# EAGLE design IoT_Pro_01 (EAGLE 7.3.0)
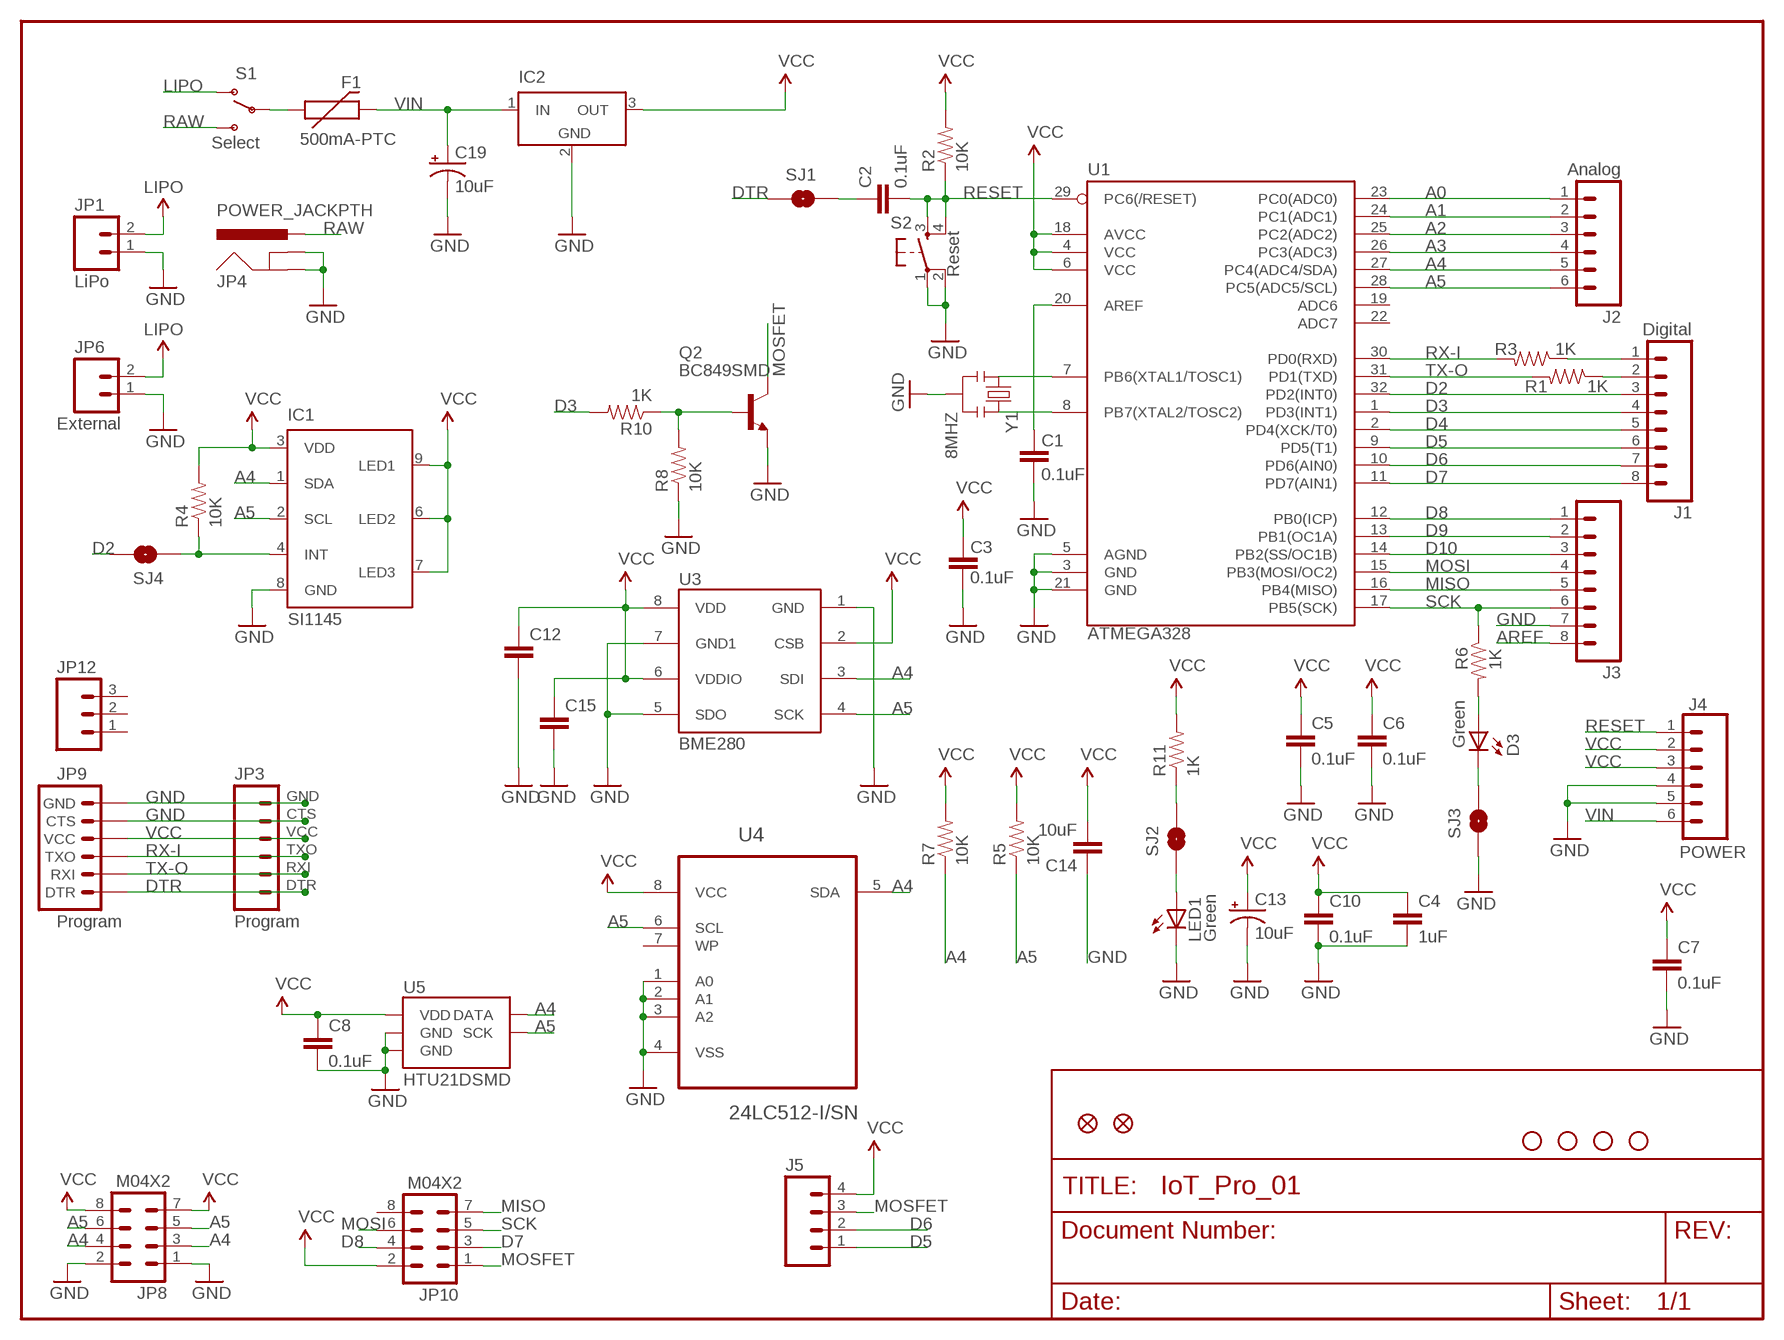
[diagram p0: schematic, sheet 1]

## Parts
C1  0.1uF  CAP0805  [0805]
C2  0.1uF  CAP0805  [0805]
C3  0.1uF  CAP0805  [0805]
C4  1uF  CAP0805  [0805]
C5  0.1uF  CAP0805  [0805]
C6  0.1uF  CAP0805  [0805]
C7  0.1uF  CAP0805  [0805]
C8  0.1uF  CAP0805  [0805]
C10  0.1uF  CAP0805  [0805]
C12  CAP0805  [0805]
C13  10uF  CAP_POL1206  [EIA3216]
C14  10uF  CAP0805  [0805]
C15  CAP0805  [0805]
C19  10uF  CAP_POL1206  [EIA3216]
D3  Green  LG_T679-E1F1-1  [PLCC2]
F1  500mA-PTC  PTCSMD  [PTC-1206]
IC1  SI1145  [QFN-10]
IC2  LT1129CST5  [SOT223]
J1  Digital  M081X08  [1X08]
J2  Analog  M06SIP  [1X06]
J3  M081X08  [1X08]
J4  POWER  M06SIP  [1X06]
J5  M04PTH  [1X04]
JP1  LiPo  M02POLAR  [MOLEX-1X2]
JP2  FIDUCIAL1X2.5  [FIDUCIAL-1X2.5]
JP3  Program  M06SIP  [1X06]
JP4  POWER_JACKPTH  [POWER_JACK_PTH]
JP5  FIDUCIAL1X2.5  [FIDUCIAL-1X2.5]
JP6  External  M02PTH  [1X02]
JP8  M04X2  [2X4]
JP9  Program  ARDUINO_SERIAL_PROGRAMSMD  [1X06-SMD]
JP10  M04X2  [2X4]
JP12  M03PTH  [1X03]
LED1  Green  LG_T679-E1F1-1  [PLCC2]
Q2  BC849SMD  [SOT23-BEC]
R1  1K  RESISTOR0805-RES  [0805]
R2  10K  RESISTOR0805-RES  [0805]
R3  1K  RESISTOR0805-RES  [0805]
R4  10K  RESISTOR0805-RES  [0805]
R5  10K  RESISTOR0805-RES  [0805]
R6  1K  RESISTOR0805-RES  [0805]
R7  10K  RESISTOR0805-RES  [0805]
R8  10K  RESISTOR0805-RES  [0805]
R10  1K  RESISTOR0805-RES  [0805]
R11  1K  RESISTOR0805-RES  [0805]
S1  Select  SWITCH-SPDT-SMD-A  [SWITCH-SPST-SMD-A]
S2  Reset  TAC_SWITCHSMD  [TACTILE_SWITCH_SMD]
SJ1  SOLDERJUMPERNC2  [SJ_2S-NOTRACE]
SJ2  SOLDERJUMPERNC2  [SJ_2S-NOTRACE]
SJ3  SOLDERJUMPERNC2  [SJ_2S-NOTRACE]
SJ4  SOLDERJUMPERNC2  [SJ_2S-NOTRACE]
U1  ATMEGA328  ATMEGA168  [TQFP32-08]
U3  BME280  [BME280]
U4  24LC512-I/SN  [SOIC127P600X175-8N]
U5  HTU21DSMD  [HTU21D]
U$1  STAND-OFFTIGHT  [STAND-OFF-TIGHT]
U$3  STAND-OFFTIGHT  [STAND-OFF-TIGHT]
U$9  STAND-OFFTIGHT  [STAND-OFF-TIGHT]
U$10  STAND-OFFTIGHT  [STAND-OFF-TIGHT]
Y1  8MHZ  RESONATOR8MHZ  [RESONATOR-SMD]

## Nets
A0: J2.1 U1.23(PC0(ADC0))
A1: J2.2 U1.24(PC1(ADC1))
A2: J2.3 U1.25(PC2(ADC2))
A3: J2.4 U1.26(PC3(ADC3))
A4: IC1.1(SDA) J2.5 JP8.3 JP8.4 R7.1 U1.27(PC4(ADC4/SDA)) U3.3(SDI) U4.5(SDA) U5.DATA
A5: IC1.2(SCL) J2.6 JP8.5 JP8.6 R5.1 U1.28(PC5(ADC5/SCL)) U3.4(SCK) U4.6(SCL) U5.SCK
AREF: C1.2 J3.8 U1.20(AREF)
D2: J1.3 SJ4.2 U1.32(PD2(INT0))
D3: J1.4 R10.2 U1.1(PD3(INT1))
D4: J1.5 U1.2(PD4(XCK/T0))
D5: J1.6 J5.1 U1.9(PD5(T1))
D6: J1.7 J5.2 U1.10(PD6(AIN0))
D7: J1.8 JP10.3 U1.11(PD7(AIN1))
D8: J3.1 JP10.4 U1.12(PB0(ICP))
D9: J3.2 U1.13(PB1(OC1A))
D10: J3.3 U1.14(PB2(SS/OC1B))
DTR: JP3.DTR JP9.1(DTR) SJ1.1
GND [vcc]: C1.1 C3.1 C4.2 C5.2 C6.2 C7.2 C8.2 C10.2 C12.2 C13.C(-) C14.1 C15.2 C19.C(-) IC1.8(GND) IC2.2(GND) J3.7 J4.4 J4.5 JP1.1 JP3.CTS JP3.GND JP4.GND JP4.GNDBREAK JP6.1 JP8.1 JP8.2 JP9.5(CTS) JP9.6(GND) LED1.C Q2.E R8.1 S2.1 S2.2 SJ3.1 U1.3(GND) U1.5(AGND) U1.21(GND) U3.1(GND) U3.5(SDO) U3.7(GND1) U4.1(A0) U4.2(A1) U4.3(A2) U4.4(VSS) U5.7(GND) U5.GND Y1.2
LIPO: JP1.2 JP6.2 S1.1(O)
MISO: J3.5 JP10.7 U1.16(PB4(MISO))
MOSFET: J5.3 JP10.1 Q2.C
MOSI: J3.4 JP10.6 U1.15(PB3(MOSI/OC2))
N$1: C2.1 SJ1.2
N$3: U1.7(PB6(XTAL1/TOSC1)) Y1.1
N$4: U1.8(PB7(XTAL2/TOSC2)) Y1.3
N$6: LED1.A SJ2.1
N$7: D3.A R6.2
N$8: R11.1 SJ2.2
N$9: D3.C SJ3.2
N$10: IC1.4(INT) R4.1 SJ4.1
N$14: Q2.B R8.2 R10.1
N$25: F1.1 S1.2(P)
RAW [vcc]: JP4.PWR S1.3(S)
RESET: C2.2 J4.1 R2.1 S2.3 S2.4 U1.29(PC6(/RESET))
RX-I: JP3.TXO JP9.3(TXO) R3.2 U1.30(PD0(RXD))
RX-IP: J1.2 R1.1
SCK: J3.6 JP10.5 R6.1 U1.17(PB5(SCK))
TX-O: JP3.RXI JP9.2(RXI) R1.2 U1.31(PD1(TXD))
TX-OP: J1.1 R3.1
VCC: C3.2 C4.1 C5.1 C6.1 C7.1 C8.1 C10.1 C12.1 C13.A(+) C14.2 C15.1 IC1.3(VDD) IC1.6(LED2) IC1.7(LED3) IC1.9(LED1) IC2.3(OUT) J4.2 J4.3 J5.4 JP3.VCC JP8.7 JP8.8 JP9.4(VCC) JP10.2 R2.2 R4.2 R5.2 R7.2 R11.2 U1.4(VCC) U1.6(VCC) U1.18(AVCC) U3.2(CSB) U3.6(VDDIO) U3.8(VDD) U4.8(VCC) U5.VDD
VIN [vcc]: C19.A(+) F1.2 IC2.1(IN) J4.6
Unconnected: JP10.8 JP12.1 JP12.2 JP12.3 U1.19(ADC6) U1.22(ADC7) U4.7(WP)

## Power pins joined to a net without a drawn wire
GND: IC2.4(GND)

## Library data of the parts
C1-C8 C10 = SparkFun:CAP: Capacitor Standard 0603 ceramic capacitor, and 0.1" leaded capacitor.
C12 C14 C15 = SparkFun-Capacitors:CAP: Capacitor Standard 0603 ceramic capacitor, and 0.1" leaded capacitor.
C13 C19 = SparkFun:CAP_POL: Capacitor Polarized These are standard SMD and PTH capacitors. Normally 10uF, 47uF, and 100uF in electrolytic and tantalum varieties. Always verify the external diameter of the through hole cap, it varies with capacity, voltage, and manufacturer. The EIA devices should be standard.
D3 LED1 = led:*_T679-?-1: LC TOPLED® Low Current LED Source: http://catalog.osram-os.com .. LG_LS_LY_T679_OBS.pdf; COLOR: green
F1 = SparkFun:PTC: Resettable Fuse PTC Resettable Fuse. Spark Fun Electronics SKU : COM-08357
IC1 = silabs:SI114*: PROXIMITY/UV/AMBIENT LIGHT SENSOR IC WITH I2C INTERFACE Source: http://www.silabs.com/Support%20Documents/TechnicalDocs/Si1145-46-47.pdf
IC2 = linear-technology:LT1129CST5: VOLTAGE REGULATOR with shutdown; MPN: LT1129CST-5#PBF; OC_FARNELL: 1663375; OC_NEWARK: 57M2069
J1 J3 = SparkFun:M08: Header 8 Standard 8-pin 0.1" header. Use with straight break away headers (SKU : PRT-00116), right angle break away headers (PRT-00553), swiss pins (PRT-00743), machine pins (PRT-00117), and female headers (PRT-00115).
J2 J4 = SparkFun:M06: Header 6 Standard 6-pin 0.1" header. Use with straight break away headers (SKU : PRT-00116), right angle break away headers (PRT-00553), swiss pins (PRT-00743), machine pins (PRT-00117), and female headers (PRT-00115). Molex polarized connector foot print use with SKU : PRT-08094 with associated ...
J5 = SparkFun-Connectors:M04: Header 4 Standard 4-pin 0.1" header. Use with straight break away headers (SKU : PRT-00116), right angle break away headers (PRT-00553), swiss pins (PRT-00743), machine pins (PRT-00117), and female headers (PRT-00115). Molex polarized connector foot print use with SKU : PRT-08231 with associated crimp pins and housings. 1MM SMD Version SKU: PRT-10208; PROD_ID: CONN-09696
JP1 = SparkFun-Connectors:M02: Standard 2-pin 0.1" header. Use with - straight break away headers ( PRT-00116) - right angle break away headers (PRT-00553) - swiss pins (PRT-00743) - machine pins (PRT-00117) - female headers (PRT-00115) Molex polarized connector foot print use with: PRT-08233 with associated crimp pins and housings. 2.54_SCREWTERM for use with PRT-10571. 3.5mm Screw Terminal footprints for PRT-08084 5mm Screw Terminal footprints for use with PRT-08432
JP2 JP5 = abes:FIDUCIAL: Fiducial Alignment Points Various fiducial points for machine vision alignment.
JP3 = SparkFun-Connectors:M06: Header 6 Standard 6-pin 0.1" header. Use with straight break away headers (SKU : PRT-00116), right angle break away headers (PRT-00553), swiss pins (PRT-00743), machine pins (PRT-00117), and female headers (PRT-00115). Molex polarized connector foot print use with SKU : PRT-08094 with associated ...
JP4 = SparkFun:POWER_JACK: Power Jack This is the standard 5.5mm barrel jack for power. The PTH is the most common, proven, reliable, footprint. All others are experimental. The Slot footprint only works if the mill layer is transmitted to the PCB fab house so be warned. Spark Fun Electronics SKU : PRT-00119. Mating wall wart : TOL-00298 (and others)
JP6 = SparkFun:M02: Header 2 Standard 2-pin 0.1" header. Use with straight break away headers (SKU : PRT-00116), right angle break away headers (PRT-00553), swiss pins (PRT-00743), machine pins (PRT-00117), and female headers (PRT-00115). Molex polarized connector foot print use with SKU : PRT-08233 with associated crimp pins and housings.
JP8 JP10 = SparkFun-Connectors:M04X2: .1" header, two rows of four.
JP9 = SparkFun:ARDUINO_SERIAL_PROGRAM
JP12 = SparkFun-Connectors:M03: Header 3 Standard 3-pin 0.1" header. Use with straight break away headers (SKU : PRT-00116), right angle break away headers (PRT-00553), swiss pins (PRT-00743), machine pins (PRT-00117), and female headers (PRT-00115). Molex polarized connector foot print use with SKU : PRT-08232 with associated crimp pins and housings.
Q2 = transistor-npn:BC849*: NPN Transistor
R1-R8 R10 R11 = SparkFun:RESISTOR: Resistor Basic schematic elements and footprints for 0603, 1206, and PTH resistors.
S1 = SparkFun-Electromechanical:SWITCH-SPDT: SPDT Switch Simple slide switch, Spark Fun Electronics SKU : COM-00102 DPDT SMT slide switch, AYZ0202, SWCH-08179
S2 = SparkFun:TAC_SWITCH: Momentary Switch Button commonly used for reset or general input. Spark Fun Electronics SKU : COM-00097
SJ1-SJ4 = SparkFun:SOLDERJUMPER: Solder Jumper Standard SMD solder jumper. Used to automate production. Two varients : Normally Open and Normally Closed are the same, but have different paste layers. NC will have a large amount of paste and should jumper during reflow.
U1 = SparkFun:ATMEGA168
U3 = mojaknižnica:BME280: BOSCH BME280
U4 = Microchip-24LCxxx:24LC: IC, I2C™ Serial EEPROM; MPN: 24LC512-I/SN; OC_FARNELL: 1801220; OC_NEWARK: 08R2186; PACKAGE: SOIC-8; SUPPLIER: MICROCHIP
U5 = SparkFun-Sensors:HTU21D
U$1 U$3 U$9 U$10 = SparkFun-Electromechanical:STAND-OFF: #4 Stand Off This is the mechanical footprint for a #4 phillips button head screw. Use the keepout ring to avoid running the screw head into surrounding components. SKU : PRT-00447
Y1 = SparkFun-FreqCtrl:RESONATOR: Resonator Small SMD resonator. Used, eg, on the Arduino Pro/ Pro Mini boards. 8MHz- XTAL-08895 16MHz- XTAL-08900; PROD_ID: XTAL-08895

## Net classes
0 default: width 0.203 mm
1 vcc: width 0.254 mm

## Board
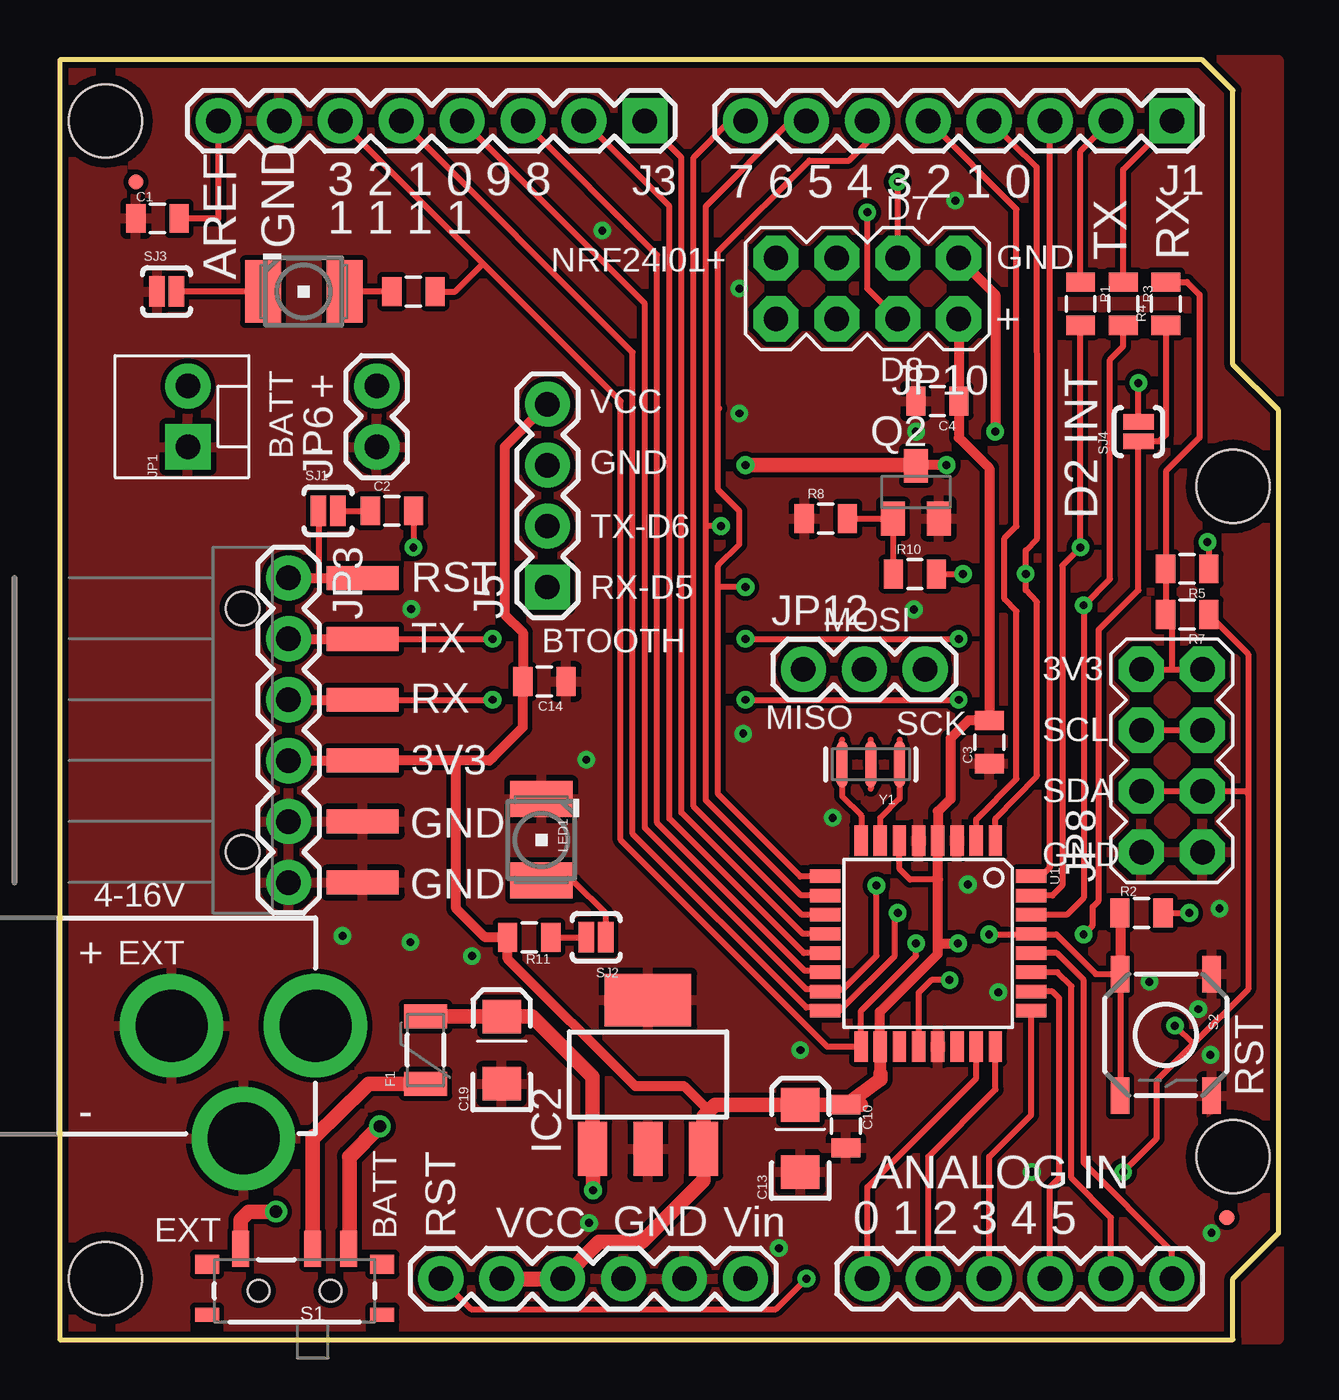
[diagram p1: board, top side]
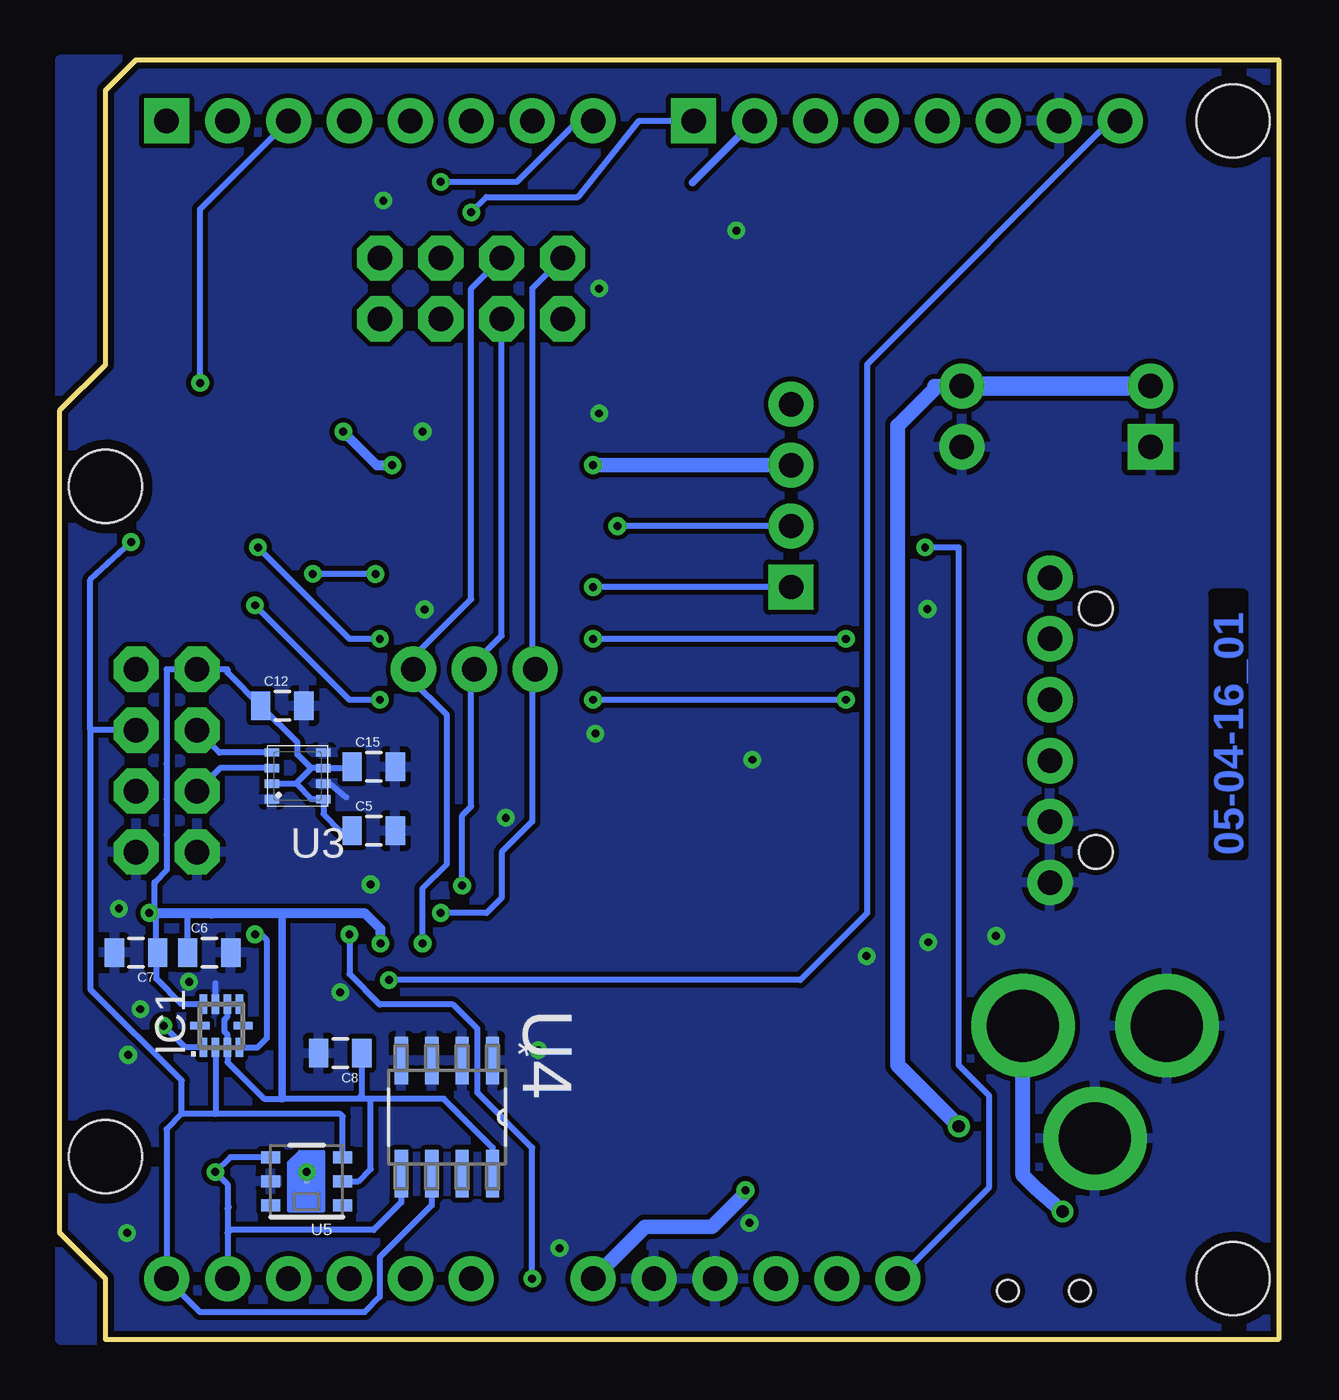
[diagram p2: board, bottom side, seen from below]

Size 50.8 x 53.34 mm. Coordinates in mm from the lower left corner, seen from the top.
Outline: 0,53.34 0,0 48.9,0 48.9,2.54 50.8,4.45 50.8,38.73 48.9,40.64 48.9,52.07 47.62,53.34 0,53.34
Copper layers (1*16): Top 0.035mm / dielectric 1.5mm / Bottom 0.035mm
Design rules "default *": minimum track width 10mil, minimum drill 12mil, track to track 8mil, track to pad 8mil, pad to pad 8mil, via to via 8mil, smd to smd 8mil, copper to edge 10mil, drill to drill 8mil, minimum pad ring 10mil, minimum via ring 8mil, stop-mask expansion 4mil, vias tented up to drill 20mil, thermal gap 10mil

### Footprints (pad centres in the part's own frame; a part is rotated, then mirrored left to right if it is on the bottom)
0805 = smd 0.8 x 1.2: 1 -0.9,0; 2 0.9,0
EIA3216 = smd 1.4 x 1.6: A 1.4,0; C -1.4,0
PLCC2 = smd 2.6 x 1.5: A 0,1.7; C 0,-1.7
PTC-1206 = smd 1 x 1.8: 1 -1.4,0; 2 1.4,0
QFN-10 = smd 0.8 x 0.3: 1 -0.9,0.75; 2 -0.9,0.25; 3 -0.9,-0.25; 4 -0.9,-0.75; 6 0.9,-0.75; 7 0.9,-0.25; 8 0.9,0.25; 9 0.9,0.75 | smd 0.3 x 0.8: 5 0,-0.9; 10 0,0.9
SOT223 = smd 1.219 x 2.235: 1 -2.311,-3.099; 2 0,-3.099; 3 2.311,-3.099 | smd 3.6 x 2.2: 4 0,3.099
1X08 = drill 1.016 pad 1.88 square: 1 0,0 | drill 1.016 pad 1.88: 2 2.54,0; 3 5.08,0; 4 7.62,0; 5 10.16,0; 6 12.7,0; 7 15.24,0; 8 17.78,0
1X06 = drill 1.016 pad 1.88: 1 0,0; 2 2.54,0; 3 5.08,0; 4 7.62,0; 5 10.16,0; 6 12.7,0
1X04 = drill 1.016 pad 1.88 square: 1 0,0 | drill 1.016 pad 1.88: 2 2.54,0; 3 5.08,0; 4 7.62,0
MOLEX-1X2 = drill 1.016 pad 1.88 square: 1 0,0 | drill 1.016 pad 1.88: 2 2.54,0
FIDUCIAL-1X2.5 = smd 0.635 x 0.635: 1 0,0
1X06' = drill 1.016 pad 1.88: CTS 10.16,0; DTR 0,0; GND 12.7,0; RXI 2.54,0; TXO 5.08,0; VCC 7.62,0
POWER_JACK_PTH = drill 2.997 pad 4.318: GND 0,7.7; GNDBREAK 4.7,10.7; PWR 0,13.7
1X02 = drill 1.016 pad 1.88: 1 0,0; 2 2.54,0
2X4 = drill 1.016 pad 1.88 octagon: 1 -3.81,-1.27; 2 -3.81,1.27; 3 -1.27,-1.27; 4 -1.27,1.27; 5 1.27,-1.27; 6 1.27,1.27; 7 3.81,-1.27; 8 3.81,1.27
1X06-SMD = smd 1 x 3: 1 -6.35,5; 2 -3.81,5; 3 -1.27,5; 4 1.27,5; 5 3.81,5; 6 6.35,5 | hole 1.4: -5.08,0; 5.08,0
1X03 = drill 1.016 pad 1.88: 1 0,0; 2 2.54,0; 3 5.08,0
SOT23-BEC = smd 1 x 1.4: B -0.95,-1.1; C 0,1.1; E 0.95,-1.1
SWITCH-SPST-SMD-A = smd 0.7 x 1.5: 1 -2.25,-1.75; 2 -0.75,-1.75; 3 2.25,-1.75 | smd 1 x 0.6: GND1 -3.65,1; GND3 3.65,1 | smd 1 x 0.8: GND2 -3.65,-1.1; GND4 3.65,-1.1 | hole 0.9: -1.5,0; 1.5,0
TACTILE_SWITCH_SMD = smd 1.524 x 0.762: 1 -2.54,1.905; 2 2.54,1.905; 3 -2.54,-1.905; 4 2.54,-1.905
SJ_2S-NOTRACE = smd 0.635 x 1.27: 1 -0.401,0; 2 0.413,0
TQFP32-08 = smd 1.27 x 0.559: 1 -4.293,2.8; 2 -4.293,2; 3 -4.293,1.2; 4 -4.293,0.4; 5 -4.293,-0.4; 6 -4.293,-1.2; 7 -4.293,-2; 8 -4.293,-2.8; 17 4.293,-2.8; 18 4.293,-2; 19 4.293,-1.2; 20 4.293,-0.4; 21 4.293,0.4; 22 4.293,1.2; 23 4.293,2; 24 4.293,2.8 | smd 0.559 x 1.27: 9 -2.8,-4.293; 10 -2,-4.293; 11 -1.2,-4.293; 12 -0.4,-4.293; 13 0.4,-4.293; 14 1.2,-4.293; 15 2,-4.293; 16 2.8,-4.293; 25 2.8,4.293; 26 2,4.293; 27 1.2,4.293; 28 0.4,4.293; 29 -0.4,4.293; 30 -1.2,4.293; 31 -2,4.293; 32 -2.8,4.293
BME280 = smd 0.6 x 0.35: 1 1.075,0.975; 2 1.075,0.325; 3 1.075,-0.325; 4 1.075,-0.975; 5 -1.075,-0.975; 6 -1.075,-0.325; 7 -1.075,0.325; 8 -1.075,0.975
SOIC127P600X175-8N = smd 1.981 x 0.559: 1 -2.362,1.905; 2 -2.362,0.635; 3 -2.362,-0.635; 4 -2.362,-1.905; 5 2.362,-1.905; 6 2.362,-0.635; 7 2.362,0.635; 8 2.362,1.905
HTU21D = smd 0.2 x 0.2: 7 0,0 | smd 0.8 x 0.5: DATA 1.5,-1; GND 1.5,0; NC@1 -1.5,1; NC@6 1.5,1; SCK -1.5,-1; VDD -1.5,0
STAND-OFF-TIGHT = hole 3.048: 0,0
RESONATOR-SMD = smd 0.45 x 1.905: 1 -1.2,0; 2 0,0; 3 1.2,0

### Placement (x,y rotation side)
C1  4.06,46.74 0 top
C2  13.84,34.54 0 top
C3  38.75,24.91 90 top
C4  36.58,39.12 180 top
C5  37.72,21.21 0 bottom
C6  44.58,16.13 0 bottom
C7  47.62,16.13 180 bottom
C8  39.12,11.94 180 bottom
C10  32.77,8.89 270 top
C12  41.53,26.42 0 bottom
C13  30.86,8.38 90 top
C14  20.19,27.43 180 top
C15  37.72,23.88 0 bottom
C19  18.41,12.06 90 top
D3  10.16,43.69 270 top
F1  15.24,12.06 90 top
IC1  44.07,13.08 90 bottom
IC2  24.51,11.05 0 top
J1  46.35,50.8 180 top
J2  33.66,2.54 0 top
J3  24.38,50.8 180 top
J4  15.88,2.54 0 top
J5  20.32,31.37 90 top
JP1  5.33,37.21 90 top
JP2  48.64,5.08 90 top
JP3  Program  [1X06']  9.53,31.75 270 top
JP4  -3.05,13.08 270 top
JP5  3.17,48.26 0 top
JP6  13.21,37.21 90 top
JP8  46.35,24.13 90 top
JP9  7.62,25.4 270 top
JP10  33.66,43.81 180 top
JP12  30.99,27.94 0 top
LED1  20.07,20.83 180 top
Q2  35.68,35.32 0 top
R1  42.55,43.18 270 top
R2  45.09,17.78 0 top
R3  44.32,43.18 270 top
R4  46.1,43.18 90 top
R5  46.99,32.13 180 top
R6  14.73,43.69 180 top
R7  46.99,30.23 180 top
R8  31.93,34.23 0 top
R10  35.64,31.91 0 top
R11  19.56,16.76 180 top
S1  9.78,2.03 180 top
S2  46.1,12.7 270 top
SJ1  11.18,34.54 0 top
SJ2  22.35,16.76 180 top
SJ3  4.45,43.69 0 top
SJ4  44.96,37.85 90 top
U1  36.2,16.51 270 top
U3  40.89,23.5 180 bottom
U4  34.67,9.27 270 bottom
U5  40.51,6.6 180 bottom
U$1  1.91,50.8 0 top
U$3  1.91,2.54 0 top
U$9  48.9,35.56 0 top
U$10  48.9,7.62 0 top
Y1  33.8,23.98 180 top

### Tracks (layer width: path | path; a pad name or v marks a point on that pad's centre or on a via)
A0
  Top 0.254: U1.23 38.2,10.89 33.66,6.35 | J2.1 33.66,6.35 | 33.66,6.31 33.66,6.35
A1
  Top 0.254: U1.24 38.99,10.42 36.2,7.62 J2.2
A2
  Top 0.254: U1.25 40.49,9.37 38.73,7.62 38.73,2.79 38.86,2.67 J2.3
A3
  Top 0.254: U1.26 41.37,14.51 41.66,14.22 41.66,6.73 41.27,6.35 J2.4
A4  (via drill 0.33)
  Top 0.254: U1.27 41.59,15.31 42.16,14.73 42.16,6.73 43.81,5.08 J2.5 | R7.1 47.64,30.46 49.53,28.57 49.53,22.73 | 49.53,22.73 49.53,14.61 47.24,12.32 | v44.32,6.99 45.72,8.38 45.72,10.79 47.24,12.32 | JP8.4 JP8.3 49.4,22.86 49.53,22.73 | v46.48,13.08 47.24,12.32
  Bottom 0.254: 43.81,5.46 43.81,6.48 v44.32,6.99 43.7,7.6 U5.DATA | 43.81,5.46 43.81,4.45 | 43.81,4.45 J2.5 | 43.76,5.51 43.81,5.46 | U3.3 44.12,23.82 JP8.4 | IC1.1 45.58,12.18 v46.48,13.08 | U4.5 36.58,5.71 37.72,4.57 43.69,4.57 43.81,4.45
A5  (via drill 0.33)
  Top 0.254: U1.28 41.55,16.11 42.67,14.99 42.67,7.37 46.35,3.68 J2.6 | 47.62,32.38 R5.1 47.9,32.39 47.9,33.03 47.84,33.23 v47.84,33.24 | JP8.6 JP8.5
  Bottom 0.254: 45.72,9.4 45.72,10.79 49.53,14.61 49.53,25.4 | 49.53,25.4 49.53,31.67 v47.84,33.24 | JP8.5 49.53,25.4 | U3.4 44.16,24.47 JP8.6 | 44.32,9.4 39.12,9.4 39.01,9.29 U5.SCK | 44.32,9.4 45.72,9.4 | 45.72,9.4 46.35,8.76 J2.6 44.96,1.14 38.1,1.14 37.47,1.78 37.47,3.43 35.31,5.59 U4.6 | IC1.2 44.32,9.4
AREF  (via drill 0.33)
  Top 0.254: U1.20 35.8,14.46 36.32,14.99 v37.08,14.99 | J3.8 6.6,46.74 C1.2
  Bottom 0.254: v37.08,14.99 19.94,14.99 17.14,17.78 17.14,40.66 6.99,50.82 J3.8
D2  (via drill 0.33)
  Top 0.254: U1.32 40.89,19.31 40.89,19.3 41.27,19.68 J1.3 | SJ4.2 44.96,39.62 45.09,39.75 v44.96,39.88
  Bottom 0.254: v44.96,39.88 44.96,47.12 J1.3
D3  (via drill 0.33)
  Top 0.254: U1.1 38.99,21.72 40.72,23.5 40.72,23.53 40.73,30.73 40.26,31.24 v40.26,31.92 40.26,32.89 40.73,33.39 40.72,48.88 J1.4 | R10.2 v37.65,31.91
  Bottom 0.254: v40.26,31.92 39.02,31.91 v37.65,31.91
D4
  Top 0.254: U1.2 38.2,21.68 39.88,23.37 39.88,30.35 39.37,30.86 39.37,33.4 39.88,33.91 39.88,47.12 J1.5
D5  (via drill 0.33)
  Top 0.254: U1.9 32,19.3 | U1.9 | U1.9 30.86,19.3 27.43,22.73 27.43,31.37 | 27.43,31.37 27.43,32.26 28.32,33.15 28.32,34.54 27.43,35.43 27.43,38.86 | 27.43,38.86 27.43,45.34 31.24,49.15 32.89,49.15 33.66,49.91 J1.6 | 27.43,38.86 27.48,38.81 | v28.57,31.37 27.43,31.37
  Bottom 0.254: J5.1 v28.57,31.37
D6  (via drill 0.33)
  Top 0.254: U1.10 31.78,18.51 31.75,18.54 30.86,18.54 26.92,22.48 26.92,33.91 | 26.92,33.91 26.92,47.24 30.48,50.8 J1.7 | v27.56,33.91 26.92,33.91
  Bottom 0.254: J5.2 v27.56,33.91
D7  (via drill 0.33)
  Top 0.254: U1.11 30.93,17.71 26.42,22.23 26.42,49.28 27.94,50.8 J1.8 | JP10.3 v34.92,48.26
  Bottom 0.254: J1.8 29.21,50.8 31.75,48.26 v34.92,48.26
D8  (via drill 0.33)
  Top 0.254: U1.12 30.97,16.91 25.91,21.97 25.91,49.28 J3.1 | v33.66,46.99 33.66,43.81 JP10.4
  Bottom 0.254: J3.1 26.67,50.8 29.21,47.62 33.02,47.62 v33.66,46.99
D9
  Top 0.254: U1.13 31.01,16.11 25.4,21.72 25.4,47.24 J3.2
  Bottom 0.305: 24.42,48.22 J3.2
D10
  Top 0.254: J3.3 24.89,45.21 24.89,21.53 31.05,15.37 31.88,15.37 31.88,15.34 U1.14
DTR
  Top 0.254: 10.79,31.88 10.71,31.8 JP9.1 | SJ1.1 10.78,31.77 10.41,31.75
  Top 0.406: JP3.DTR 10.41,31.75 JP9.1
GND  (via drill 0.33)
  Top 0: v40.51,6.99 U5.7
  Bottom 0.254: U3.7 39.55,23.17 38.86,22.61 | IC1.8 44.32,14.86
  other vias: 32.21,21.75 21.94,24.17 35.69,37.85 48.01,4.45 37.85,18.97 22.06,4.86 28.48,25.26 29.97,3.81 30.86,12.06 37.32,47.48 47.96,11.87 11.78,16.83 14.61,16.56 17.17,15.99 14.64,30.45 35.6,30.43 28.32,43.81 28.32,38.61 22.61,46.23 39.12,14.48 47.45,13.77 48.34,17.96 45.42,14.92
  pour Top: 0,53.34 50.8,53.34 50.8,0 0,0
  pour Bottom: 0,53.34 50.8,53.34 50.8,0 0,0
  pour Top (rank 3, no thermals): 39.88,3.05 40.13,3.05 40.13,2.03 39.88,2.03
LIPO  (via drill 0.51)
  Top 0.61: 12.06,7.62 12.08,7.33 12.06,7.33 12.06,4.45 12.03,4.45 S1.1
  Top 0.635: 12.06,7.62 v13.34,8.89
  Bottom 0.61: 15.88,38.1 14.35,39.62 14.35,39.75 JP6.2
  Bottom 0.635: 15.88,38.1 15.88,11.43 v13.34,8.89
  Bottom 0.813: JP1.2 JP6.2
MISO  (via drill 0.33)
  Top 0.254: J3.5 23.88,41.15 23.88,21.08 31.11,13.84 32,13.84 31.9,13.74 U1.16 | U1.16 | U1.16 32,13.71 32,13.72 32.51,13.72 34.8,16 34.8,17.65 v34.92,17.78
  Bottom 0.254: JP10.7 31.11,43.81 31.11,21.59 32.38,20.32 32.38,18.41 33.02,17.78 v34.92,17.78
MOSFET  (via drill 0.33)
  Top 0.406: JP10.1 38.99,43.56 v38.99,37.85 | v36.96,36.45 35.94,36.45 Q2.C
  Top 0.61: v28.57,36.45 35.56,36.45 Q2.C
  Bottom 0.406: v38.99,37.85 37.59,36.45 v36.96,36.45
  Bottom 0.61: J5.3 v28.57,36.45
MOSI  (via drill 0.33)
  Top 0.254: J3.4 24.38,43.18 24.38,21.34 31.11,14.61 31.88,14.61 31.9,14.58 U1.15 | 32,14.48 31.93,14.48 U1.15 | v34.04,18.92 34.04,16 32.64,14.61 32.13,14.61 32,14.48 | 32,14.48 31.97,14.51 U1.15
  Bottom 0.254: v34.04,18.92 34.04,21.84 33.66,22.23 33.66,28.07 32.38,29.34 JP10.6
N$1
  Top 0.254: SJ1.2 C2.1
N$3
  Top 0.254: 35,22.96 35,22.55 34.2,21.75 U1.7
N$4
  Top 0.254: 32.6,22.96 32.6,22.64 33.4,21.84 U1.8
N$5
  pour Bottom: 34.8,51.31 35.05,51.31 35.05,50.29 34.8,50.29
N$6
  Top 0.254: LED1.A 19.54,19.1 21.41,19.1 22.75,17.76 SJ2.1
N$7
  Top 0.254: R6.2 D3.A
N$8
  Top 0.254: R11.1 SJ2.2
N$9
  Top 0.254: D3.C SJ3.2
N$10  (via drill 0.33)
  Top 0.254: v42.67,16.89 43.05,17.27 43.05,18.03 43.31,18.29 43.31,29.59 44.96,31.24 SJ4.1 45.83,37.45 46.1,37.72 R4.1
  Bottom 0.254: IC1.4 42.56,12.18 42.16,12.57 42.16,16.64 42.42,16.89 v42.67,16.89
N$14
  Top 0.254: R8.2 Q2.B R10.1
N$16
  pour Top: 34.8,51.31 35.05,51.31 35.05,50.29 34.8,50.29
N$22
  pour Bottom: 32.13,28.32 32.38,28.32 32.38,27.56 32.13,27.56
N$23
  pour Bottom: 34.67,28.32 34.92,28.32 34.92,27.56 34.67,27.56
N$25
  Top 0.61: S1.2 10.53,8.47 10.64,8.47 12.67,10.47 12.87,10.66 F1.1
RAW  (via drill 0.51)
  Top 0.61: JP4.PWR 10.65,13.11 9.45,14.31 10.65,13.11 10.63,13.11 10.63,11.26 | S1.3 7.53,4.99 7.87,5.33 v9,5.33
  Bottom 0.61: v9,5.33 10.13,6.33 10.14,6.33 10.65,6.84
  Bottom 0.635: 10.65,6.84 JP4.PWR
RESET  (via drill 0.33)
  Top 0.254: J4.1 17.14,1.27 29.84,1.27 v31.11,2.54 | v38.73,16.89 40.39,16.89 40.41,16.91 U1.29 40.62,16.91 40.64,16.89 41.53,16.89 43.18,15.24 S2.3 S2.4 | C2.2 v14.73,33.02
  Top 0.406: R2.1 S2.3
  Bottom 0.254: J4.1 12.06,6.35 12.06,10.16 13.34,11.43 13.34,33.02 v14.73,33.02 | v38.73,16.89 38.73,15.24 37.47,13.97 34.42,13.97 33.4,12.95 33.4,10.29 31.11,8 v31.11,2.54
RX-I  (via drill 0.33)
  Top 0.254: U1.30 41.97,17.71 42.67,18.41 v42.67,30.61 43.77,31.7 43.77,40.85 44.32,41.4 R3.2 | JP9.3 v18.03,26.67 | v28.57,26.67 v37.47,26.67 | 9.52,26.66 JP3.TXO
  Top 0.406: JP3.TXO JP9.3
  Bottom 0.254: v42.67,30.61 38.73,26.67 v37.47,26.67 | v18.03,26.67 v28.57,26.67
RX-IP
  Top 0.254: R1.1 42.55,49.53 J1.2
SCK  (via drill 0.33)
  Top 0.254: 17.63,44.85 23.37,39.12 23.37,20.83 31.98,12.22 U1.17 33.4,13.71 35.69,16 v35.69,16.51 | 17.63,44.85 J3.6 | 17.63,44.85 16.47,43.69 R6.1
  Bottom 0.254: JP10.5 33.66,43.81 33.66,30.86 36.2,28.32 36.2,27.56 34.67,26.04 34.67,19.81 35.69,18.8 v35.69,16.51
TX-O  (via drill 0.33)
  Top 0.254: U1.31 41.37,18.51 41.78,18.92 41.78,32.26 v42.55,33.02 42.54,34.38 42.55,34.54 R1.2 | JP9.2 v18.03,29.21 | v28.57,29.21 v37.47,29.21 | JP3.RXI
  Top 0.406: JP3.RXI JP9.2
  Bottom 0.254: v42.55,33.02 38.73,29.21 v37.47,29.21 | v18.03,29.21 v28.57,29.21
TX-OP
  Top 0.254: R3.1 44.32,48.77 J1.1
VCC  (via drill 0.33)
  Top 0.254: U1.18 34.19,12.22 | 36.6,20.9 U1.4 | U1.6 34.99,19.61 35.43,19.18 36.6,19.18 | R2.2 v47.08,17.78 | JP8.8 46.35,27.94 | 46.35,27.94 JP8.7 | 46.35,27.94 46.35,30.48 R7.2 R5.2 46.1,32.14 46.1,36.2 47.5,37.59 47.5,43.56 46.98,44.08 R4.2 | 16.52,24.04 16.43,24.13
  Top 0.406: 34.19,12.22 34.18,13.66 36.59,16.07 36.6,16.51 | 36.6,16.51 36.6,19.18 U1.4 | 36.6,16.51 v37.44,16.51 | 38.76,25.91 C3.2 | JP3.VCC JP9.4 16.43,24.13 17.91,24.13 18.03,24.26 19.29,25.51 C14.2 19.3,27.95 19.3,29.46 18.54,30.23 18.54,37.21 J5.4 | C3.2 37.87,25.8 37.13,25.06 37.13,22.52 36.6,22.02 36.6,20.83 U1.4 | 16.52,24.04 16.52,17.97 17.72,16.76 R11.2 18.67,15.88 23.98,10.57 26.01,10.57 27.05,9.53 | JP10.2 37.47,39.13 | 37.47,39.13 C4.1 | 37.47,39.13 37.47,37.59 38.73,36.32 38.73,25.82 C3.2
  Top 0.508: 34.2,11.08 U1.18
  Top 0.61: 34.2,11.08 34.2,10.84 C10.1 33.39,9.78 C13.A 27.31,9.78 27.05,9.53 26.82,9.3 IC2.3 26.82,6.63 24.26,4.06 22.48,4.06 J4.3 21.29,2.87
  Top 0.635: J4.2 J4.3
  Bottom 0.254: 46.89,17.75 v47.08,17.78 | v47.08,17.78 46.86,17.78 46.86,19.06 46.82,19.06 46.35,19.56 arc0 46.35,24 46.35,27.94 JP8.8 43.81,27.94 43.81,27.8 C12.1 40.89,24.88 40.89,24.38 40.33,23.82 40.31,23.82 | 46.8,16.08 46.8,16.13 46.8,17.76 v47.08,17.78 | 46.95,16.11 46.8,16.08 | C6.1 45.47,17.78 44.48,17.75 | 37.85,10.03 34.8,10.03 32.77,8 U4.8 32.77,6.35 | 37.85,10.03 38.35,10.03 | 38.35,10.03 41.53,10.03 42.29,10.03 43.82,11.56 IC1.3 43.82,12.7 43.94,12.83 43.94,13.34 43.81,13.46 IC1.7 IC1.6 | 40.31,23.82 40.97,23.17 | U3.2 40.97,23.17 | 40.97,23.17 40.31,22.52 U3.8 39.82,21.91 39.12,21.21 C5.1 | 38.55,23.82 C15.1 38.69,23.82 U3.6 40.31,23.82 | IC1.9 45.73,13.98 46.8,15.05 46.8,16.08 | U5.VDD 38.35,6.6 37.85,7.11 37.85,10.03 | C8.1 38.22,10.17 38.35,10.03
  Bottom 0.305: 41.53,10.03 41.53,17.75
  Bottom 0.406: v37.44,16.51 37.44,17.12 38.08,17.75 41.53,17.75 44.48,17.75 46.89,17.75 | C7.1 46.8,16.13
VIN  (via drill 0.33)
  Top 0.61: F1.2 C19.A 18.93,13.46 19.68,13.46 22.2,10.95 IC2.1 22.23,7.75 v22.23,6.22
  Bottom 0.61: J4.6 26.42,4.7 23.62,4.7 22.35,5.97 v22.23,6.22

### Text on the board
Bottom: 05-04-16_01
tPlace: 3 2 1 0 9 8 | 7 6 5 4 3 2 1 0 | D7 | 1 1 1 1 | GND | NRF24l01+ | GND | TX | RX | AREF | + | D8 | + | VCC | BATT | - | GND | D2 INT | TX-D6 | RST | RX-D5 | MOSI | TX | BTOOTH | 3V3 | RX | MISO | SCK | SCL | 3V3 | SDA | GND | GND | 4-16V | GND | EXT | + | RST | - | Vin | ANALOG IN | EXT | BATT | RST | VCC | GND | 0 1 2 3 4 5
tValues: DNP | DNP | JST-Right Angle | DNP | Production: DNP | Production: DNP | Proto: 2x3 male header up | DNP | DNP | DNP